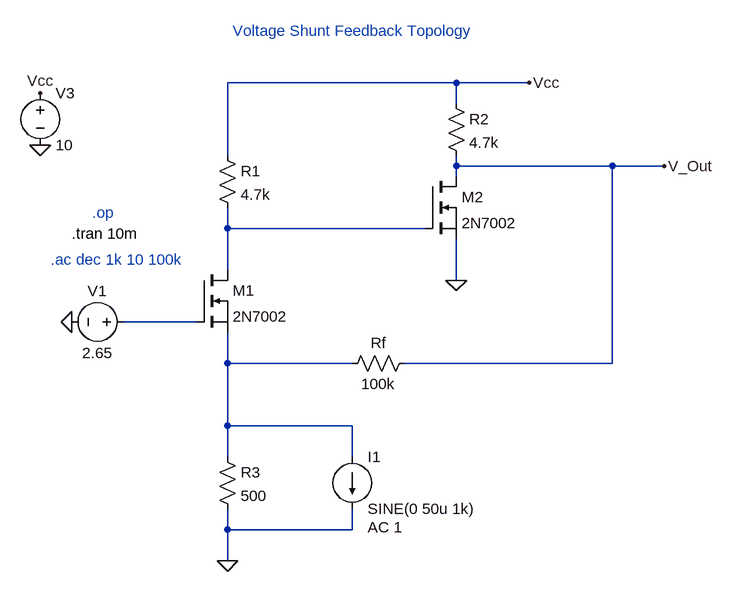
[diagram p0: schematic Voltage_Shunt_Feedback.asc]
Voltage_Shunt_Feedback.asc, the LTspice schematic file:
Version 4.1
SHEET 1 888 692
WIRE 480 -64 128 -64
WIRE 592 -64 480 -64
WIRE 480 -32 480 -64
WIRE 128 48 128 -64
WIRE 480 64 480 48
WIRE 720 64 480 64
WIRE 800 64 720 64
WIRE 480 80 480 64
WIRE 128 160 128 128
WIRE 432 160 128 160
WIRE 128 224 128 160
WIRE 480 240 480 176
WIRE 80 304 -32 304
WIRE 128 368 128 320
WIRE 320 368 128 368
WIRE 720 368 720 64
WIRE 720 368 400 368
WIRE 128 464 128 368
WIRE 320 464 128 464
WIRE 128 512 128 464
WIRE 320 512 320 464
WIRE 128 624 128 592
WIRE 320 624 320 592
WIRE 320 624 128 624
WIRE 128 672 128 624
FLAG 480 240 0
FLAG 800 64 V_Out
FLAG 592 -64 Vcc
FLAG -112 304 0
FLAG -160 32 0
FLAG -160 -48 Vcc
FLAG 128 672 0
SYMBOL nmos 80 224 R0
SYMATTR InstName M1
SYMATTR Value 2N7002
SYMBOL nmos 432 80 R0
SYMATTR InstName M2
SYMATTR Value 2N7002
SYMBOL res 112 32 R0
SYMATTR InstName R1
SYMATTR Value 4.7k
SYMBOL res 464 -48 R0
SYMATTR InstName R2
SYMATTR Value 4.7k
SYMBOL res 416 352 R90
WINDOW 0 0 56 VBottom 2
WINDOW 3 32 56 VTop 2
SYMATTR InstName Rf
SYMATTR Value 100k
SYMBOL voltage -160 -64 R0
WINDOW 123 0 0 Left 0
WINDOW 39 0 0 Left 0
SYMATTR InstName V3
SYMATTR Value 10
SYMBOL current 320 512 R0
WINDOW 123 24 108 Left 2
WINDOW 39 0 0 Left 0
SYMATTR InstName I1
SYMATTR Value SINE(0 50u 1k)
SYMATTR Value2 AC 1
SYMBOL voltage -16 304 R90
WINDOW 0 -32 56 VBottom 2
WINDOW 3 32 56 VTop 2
WINDOW 123 0 0 Left 0
WINDOW 39 0 0 Left 0
SYMATTR InstName V1
SYMATTR Value 2.65
SYMBOL res 112 496 R0
SYMATTR InstName R3
SYMATTR Value 500
TEXT -112 168 Left 2 !.tran 10m
TEXT 136 -144 Left 2 ;Voltage Shunt Feedback Topology
TEXT -80 136 Left 2 ;.op
TEXT -144 208 Left 2 ;.ac dec 1k 10 100k

The netlist it stands for:
* Voltage_Shunt_Feedback.asc
M1 N001 N002 N003 N003 2N7002
M2 V_Out N001 0 0 2N7002
R1 Vcc N001 4.7k
R2 Vcc V_Out 4.7k
Rf V_Out N003 100k
V3 Vcc 0 10
I1 N003 0 SINE(0 50u 1k) AC 1
V1 N002 0 2.65
R3 N003 0 500
.model NMOS NMOS
.model PMOS PMOS
.lib standard.mos
.tran 10m
* Voltage Shunt Feedback Topology
* .op
* .ac dec 1k 10 100k
.backanno
.end